# Altium project OSSI-1 OBC.PrjPcb
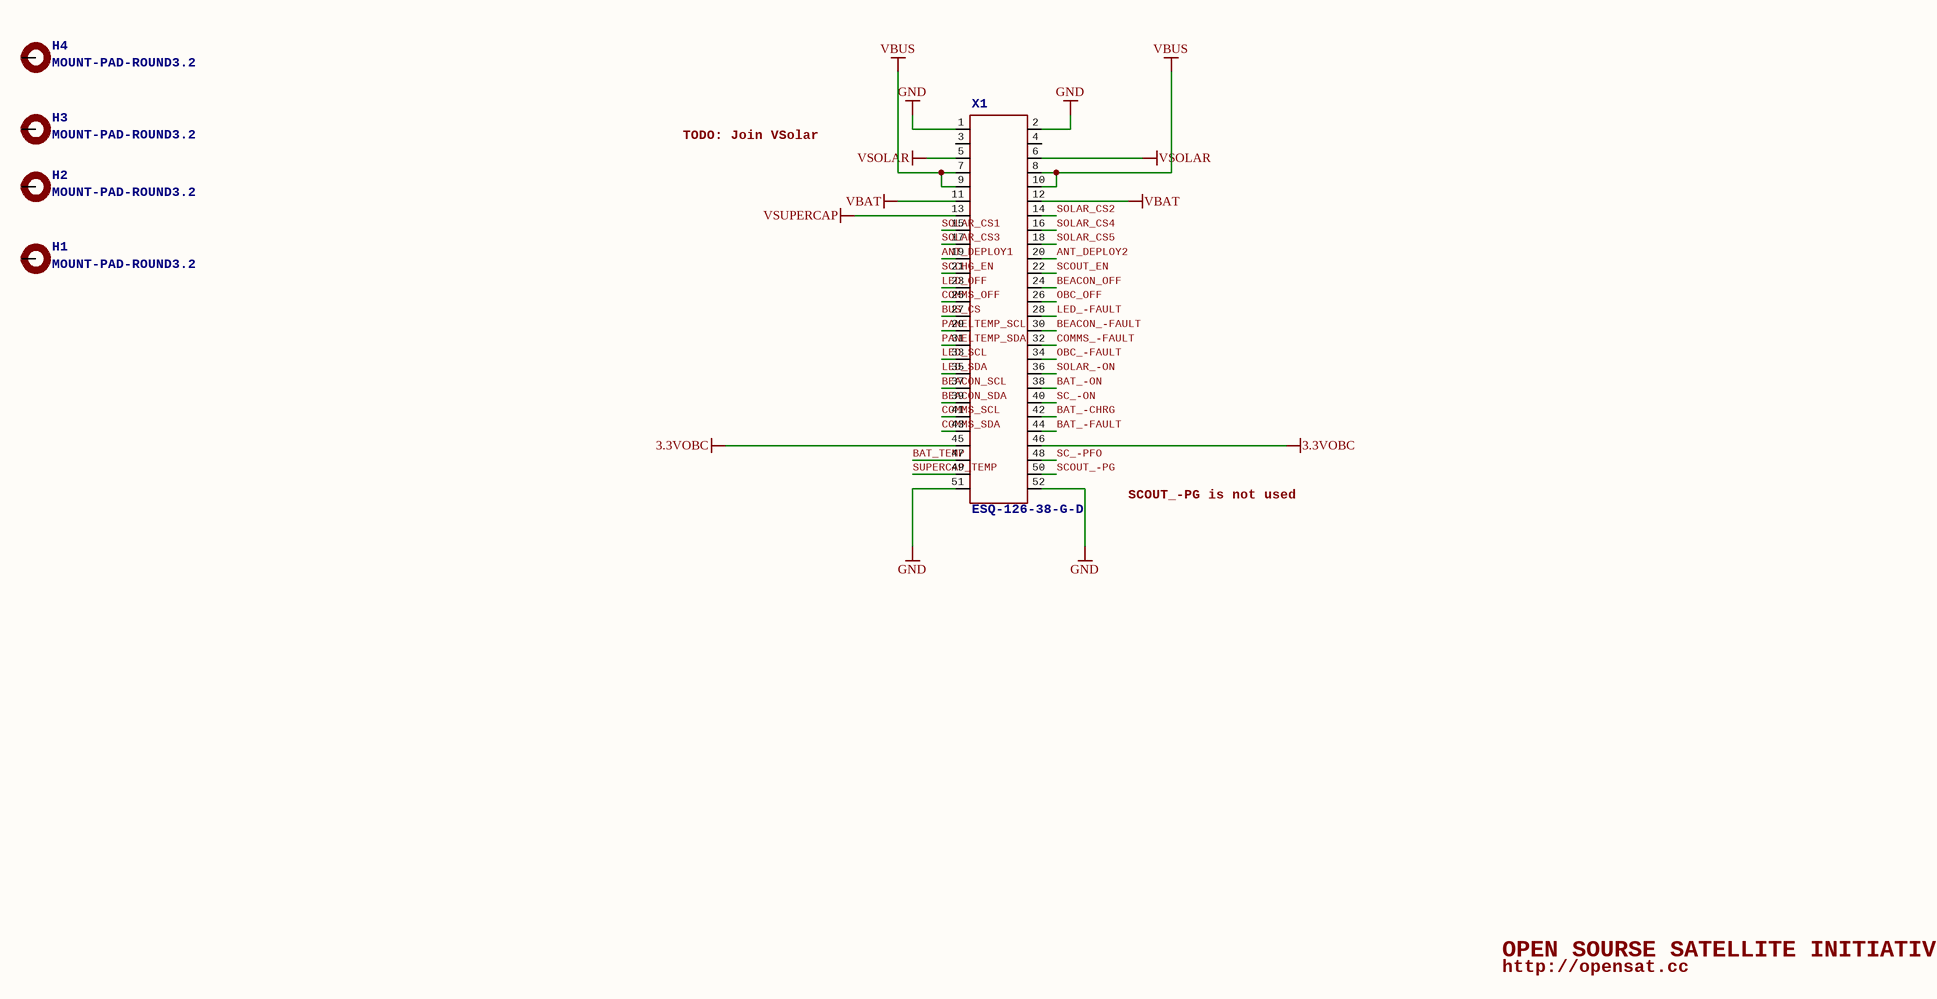
[diagram p0: OSSI-1 OBC_0.SchDoc]
4 sheets, 158 parts. Net scope: global (net labels, ports and power ports of the same name join across sheets).
Board file: OSSI-1 OBC.PcbDoc
Sheets:
  OSSI-1 OBC_0.SchDoc
  OSSI-1 OBC_1.SchDoc
  OSSI-1 OBC_2.SchDoc
  OSSI-1 OBC_3.SchDoc

## Sheet OSSI-1 OBC_0.SchDoc: TITLE:
size 410 x 286 mm; Date: Date:; >LAST_DATE_TIME: 01/11/2015 13:38:39; Sheet:: Sheet:; >SHEET: 1; REV:: REV:; Document Number:: Document Number:; >DRAWING_NAME: OSSI-1 OBC.sch

### Parts
H1  >NAME: H1  [3.2-PAD-ROUND]  (hidden comment: MOUNT-PAD-ROUND3.2)
H2  >NAME: H2  [3.2-PAD-ROUND]  (hidden comment: MOUNT-PAD-ROUND3.2)
H3  >NAME: H3  [3.2-PAD-ROUND]  (hidden comment: MOUNT-PAD-ROUND3.2)
H4  >NAME: H4  [3.2-PAD-ROUND]  (hidden comment: MOUNT-PAD-ROUND3.2)
X1  >NAME: X1  [ESQ-126-XX-X-D]  (hidden comment: ESQ-126-38-G-D)

### Nets
3.3VOBC: X1.45 X1.46
GND: X1.1 X1.2 X1.51 X1.52
VBAT: X1.11 X1.12
VBUS: X1.7 X1.8 X1.9 X1.10
VSOLAR: X1.5 X1.6
VSUPERCAP: X1.13
ANT_DEPLOY1: X1.19
ANT_DEPLOY2: X1.20
BAT_-CHRG: X1.42
BAT_-FAULT: X1.44
BAT_-ON: X1.38
BAT_TEMP: X1.47
BEACON_-FAULT: X1.30
BEACON_OFF: X1.24
BEACON_SCL: X1.37
BEACON_SDA: X1.39
BUS_CS: X1.27
COMMS_-FAULT: X1.32
COMMS_OFF: X1.25
COMMS_SCL: X1.41
COMMS_SDA: X1.43
LED_-FAULT: X1.28
LED_OFF: X1.23
LED_SCL: X1.33
LED_SDA: X1.35
OBC_-FAULT: X1.34
OBC_OFF: X1.26
PANELTEMP_SCL: X1.29
PANELTEMP_SDA: X1.31
SC_-ON: X1.40
SC_-PFO: X1.48
SCCHG_EN: X1.21
SCOUT_-PG: X1.50
SCOUT_EN: X1.22
SOLAR_-ON: X1.36
SOLAR_CS1: X1.15
SOLAR_CS2: X1.14
SOLAR_CS3: X1.17
SOLAR_CS4: X1.16
SOLAR_CS5: X1.18
SUPERCAP_TEMP: X1.49

Not connected (* = marked no-connect by the designer): H1 B3,2(MOUNT); H2 B3,2(MOUNT); H3 B3,2(MOUNT); H4 B3,2(MOUNT); X1 3 4

### Notes on the sheet
- TODO: Join VSolar
- SCOUT_-PG is not used
- OPEN SOURSE SATELLITE INITIATIVE
- http://opensat.cc

### Library data of the parts
X1 = ESQ-126-38-G-D: <b>Samtec ESQ-126-XX-G-D Elevated Sockets Seires</b> / <ul> / <li> ESQ-126-37-G-D</li> / <li> ESQ-126-38-G-D</li> / <li> ESQ-126-39-G-D</li> / </ul>; >VALUE: ESQ-126-38-G-D
H1-H4 = MOUNT-PAD-ROUND3.2: >VALUE: MOUNT-PAD-ROUND3.2

## Sheet OSSI-1 OBC_1.SchDoc: TITLE:
size 410 x 286 mm; Date: Date:; >LAST_DATE_TIME: 01/11/2015 13:38:41; Sheet:: Sheet:; >SHEET: 2; REV:: REV:; Document Number:: Document Number:; >DRAWING_NAME: OSSI-1 OBC.sch
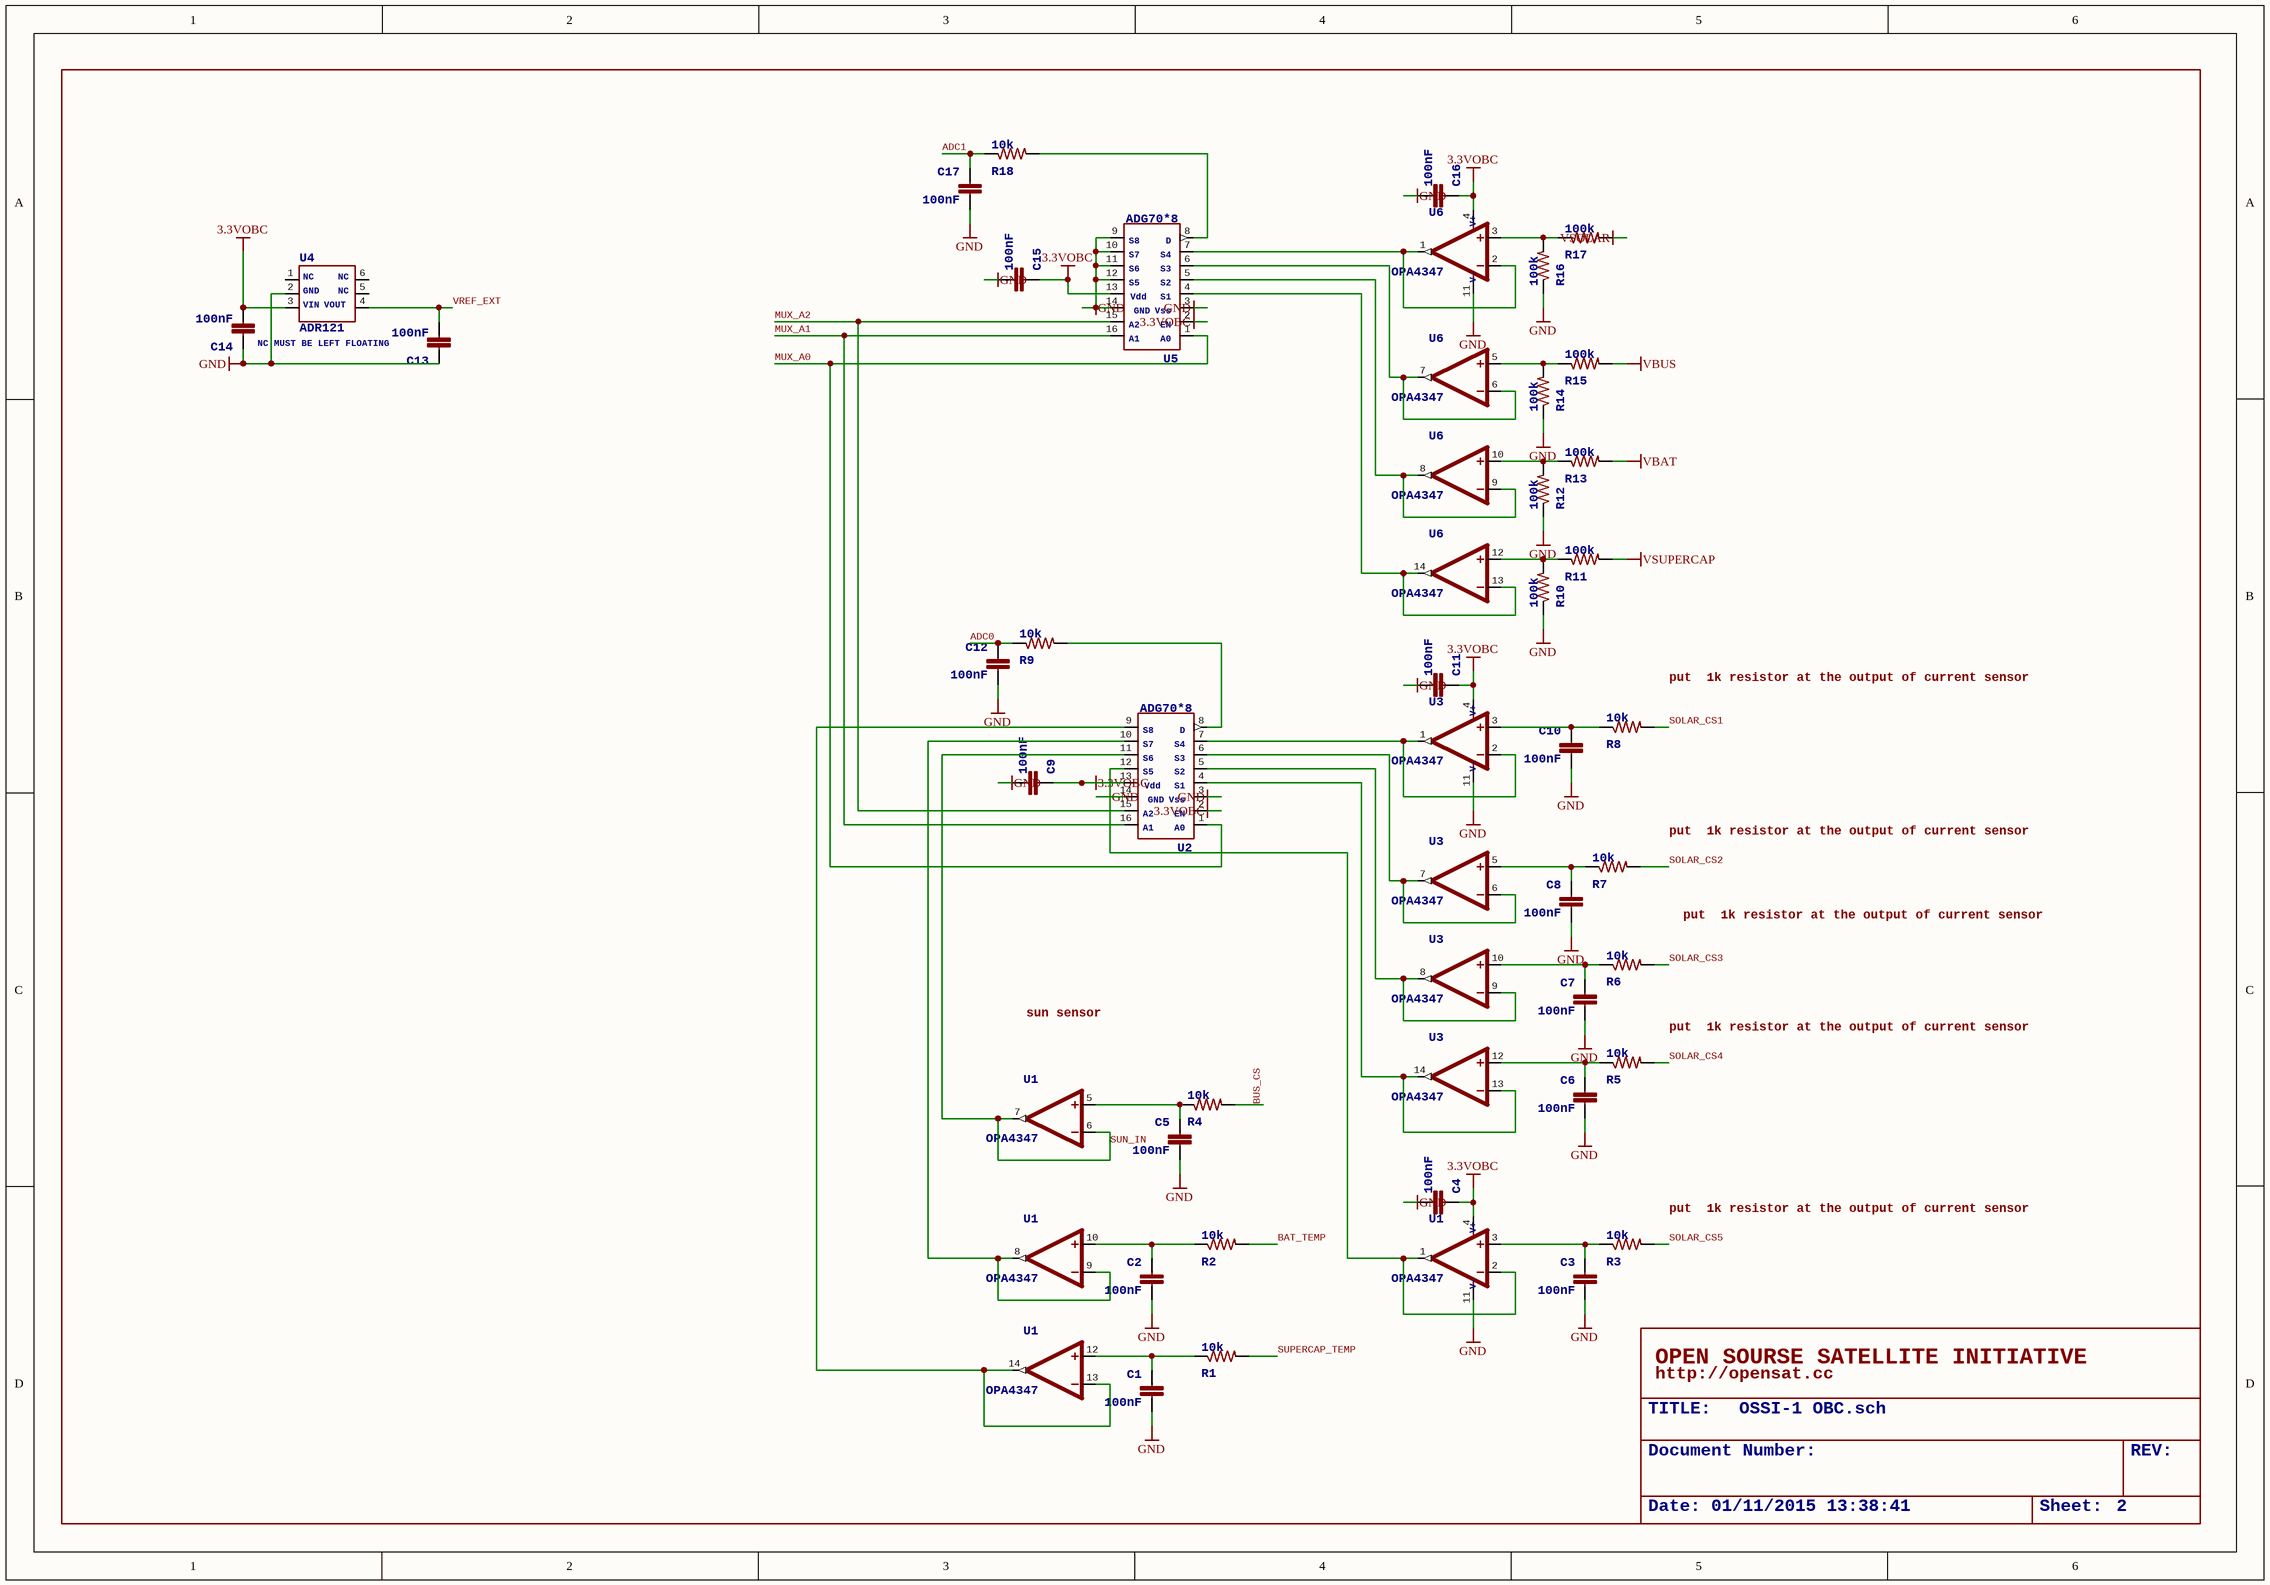
[diagram p1: OSSI-1 OBC_1.SchDoc]

### Parts
C1  >NAME: C1  [C0603(1608)]  (hidden comment: 100nF)
C2  >NAME: C2  [C0603(1608)]  (hidden comment: 100nF)
C3  >NAME: C3  [C0603(1608)]  (hidden comment: 100nF)
C4  >NAME: C4  [C0603(1608)]  (hidden comment: 100nF)
C5  >NAME: C5  [C0603(1608)]  (hidden comment: 100nF)
C6  >NAME: C6  [C0603(1608)]  (hidden comment: 100nF)
C7  >NAME: C7  [C0603(1608)]  (hidden comment: 100nF)
C8  >NAME: C8  [C0603(1608)]  (hidden comment: 100nF)
C9  >NAME: C9  [C0603(1608)]  (hidden comment: 100nF)
C10  >NAME: C10  [C0603(1608)]  (hidden comment: 100nF)
C11  >NAME: C11  [C0603(1608)]  (hidden comment: 100nF)
C12  >NAME: C12  [C0603(1608)]  (hidden comment: 100nF)
C13  >NAME: C13  [C0603(1608)]  (hidden comment: 100nF)
C14  >NAME: C14  [C0603(1608)]  (hidden comment: 100nF)
C15  >NAME: C15  [C0603(1608)]  (hidden comment: 100nF)
C16  >NAME: C16  [C0603(1608)]  (hidden comment: 100nF)
C17  >NAME: C17  [C0603(1608)]  (hidden comment: 100nF)
R1  >NAME: R1  [R0603(1608)]  (hidden comment: 10k)
R2  >NAME: R2  [R0603(1608)]  (hidden comment: 10k)
R3  >NAME: R3  [R0603(1608)]  (hidden comment: 10k)
R4  >NAME: R4  [R0603(1608)]  (hidden comment: 10k)
R5  >NAME: R5  [R0603(1608)]  (hidden comment: 10k)
R6  >NAME: R6  [R0603(1608)]  (hidden comment: 10k)
R7  >NAME: R7  [R0603(1608)]  (hidden comment: 10k)
R8  >NAME: R8  [R0603(1608)]  (hidden comment: 10k)
R9  >NAME: R9  [R0603(1608)]  (hidden comment: 10k)
R10  >NAME: R10  [R0603(1608)]  (hidden comment: 100k)
R11  >NAME: R11  [R0603(1608)]  (hidden comment: 100k)
R12  >NAME: R12  [R0603(1608)]  (hidden comment: 100k)
R13  >NAME: R13  [R0603(1608)]  (hidden comment: 100k)
R14  >NAME: R14  [R0603(1608)]  (hidden comment: 100k)
R15  >NAME: R15  [R0603(1608)]  (hidden comment: 100k)
R16  >NAME: R16  [R0603(1608)]  (hidden comment: 100k)
R17  >NAME: R17  [R0603(1608)]  (hidden comment: 100k)
R18  >NAME: R18  [R0603(1608)]  (hidden comment: 10k)
U1  >NAME: U1  [TSSOP14-PW]  (hidden comment: OPA4347)  (parts A,B,C,D of 4)
U2  >NAME: U2  [TSSOP16-RU]  (hidden comment: ADG70*8)
U3  >NAME: U3  [TSSOP14-PW]  (hidden comment: OPA4347)  (parts A,B,C,D of 4)
U4  >NAME: U4  [TSOT-6UJ-6]  (hidden comment: ADR121)
U5  >NAME: U5  [TSSOP16-RU]  (hidden comment: ADG70*8)
U6  >NAME: U6  [TSSOP14-PW]  (hidden comment: OPA4347)  (parts A,B,C,D of 4)

### Nets
3.3VOBC: C4.1 C9.1 C11.1 C14.2 C15.1 C16.1 U1.4(V+) U2.2(P$2) U2.13(P$13) U3.4(V+) U4.3(P$3) U5.2(P$2) U5.13(P$13) U6.4(V+)
GND: C1.2 C2.2 C3.2 C4.2 C5.2 C6.2 C7.2 C8.2 C9.2 C10.2 C11.2 C12.2 C13.1 C14.1 C15.2 C16.2 C17.2 R10.1 R12.1 R14.1 R16.1 U1.11(V-) U2.3(P$3) U2.14(P$14) U3.11(V-) U4.2(P$2) U5.3(P$3) U5.9(P$9) U5.10(P$10) U5.11(P$11) U5.12(P$12) U5.14(P$14) U6.11(V-)
VBAT: R13.2
VBUS: R15.2
VSOLAR: R17.2
VSUPERCAP: R11.2
ADC0: C12.1 R9.1
ADC1: C17.1 R18.1
BAT_TEMP: R2.2
BUS_CS: R4.2
MUX_A0: U2.1(P$1) U5.1(P$1)
MUX_A1: U2.16(P$16) U5.16(P$16)
MUX_A2: U2.15(P$15) U5.15(P$15)
SOLAR_CS1: R8.2
SOLAR_CS2: R7.2
SOLAR_CS3: R6.2
SOLAR_CS4: R5.2
SOLAR_CS5: R3.2
SUN_IN: U1.6(-IN) U1.7(OUT) U2.11(P$11)
SUPERCAP_TEMP: R1.2
VREF_EXT: C13.2 U4.4(P$4)
NetC1_1: C1.1 R1.1 U1.12(+IN)
NetC2_1: C2.1 R2.1 U1.10(+IN)
NetC3_1: C3.1 R3.1 U1.3(+IN)
NetC5_1: C5.1 R4.1 U1.5(+IN)
NetC6_1: C6.1 R5.1 U3.12(+IN)
NetC7_1: C7.1 R6.1 U3.10(+IN)
NetC8_1: C8.1 R7.1 U3.5(+IN)
NetC10_1: C10.1 R8.1 U3.3(+IN)
NetR9_2: R9.2 U2.8(P$8)
NetR10_2: R10.2 R11.1 U6.12(+IN)
NetR12_2: R12.2 R13.1 U6.10(+IN)
NetR14_2: R14.2 R15.1 U6.5(+IN)
NetR16_2: R16.2 R17.1 U6.3(+IN)
NetR18_2: R18.2 U5.8(P$8)
NetU1_1: U1.1(OUT) U1.2(-IN) U2.12(P$12)
NetU1_8: U1.8(OUT) U1.9(-IN) U2.10(P$10)
NetU1_13: U1.13(-IN) U1.14(OUT) U2.9(P$9)
NetU2_4: U2.4(P$4) U3.13(-IN) U3.14(OUT)
NetU2_5: U2.5(P$5) U3.8(OUT) U3.9(-IN)
NetU2_6: U2.6(P$6) U3.6(-IN) U3.7(OUT)
NetU2_7: U2.7(P$7) U3.1(OUT) U3.2(-IN)
NetU5_4: U5.4(P$4) U6.13(-IN) U6.14(OUT)
NetU5_5: U5.5(P$5) U6.8(OUT) U6.9(-IN)
NetU5_6: U5.6(P$6) U6.6(-IN) U6.7(OUT)
NetU5_7: U5.7(P$7) U6.1(OUT) U6.2(-IN)

Not connected (* = marked no-connect by the designer): U4 1(P$1) 5(P$5) 6(P$6)

### Notes on the sheet
- (near R8) put  1k resistor at the output of current sensor
- (near R7) put  1k resistor at the output of current sensor
- put  1k resistor at the output of current sensor
- sun sensor
- (near R3) put  1k resistor at the output of current sensor
- OPEN SOURSE SATELLITE INITIATIVE
- http://opensat.cc

### Library data of the parts
C1-C17 = C0603(1608): >VALUE: 100nF
R1-R18 = R0603(1608)
  R1-R9 R18: >VALUE: 10k
  R10-R17: >VALUE: 100k
U1 U3 U6 = OPA4347: <b>OPA4347</b> / <ul> / <li>RAIL-TO-RAIL INPUT AND OUTPUT</li> / <li>SINGLE SUPPLY: 2.3V to 5.5V</li> / <li>LOW IQ: 20µ</li> / </ul>; >VALUE: OPA4347; V+: V+; V-: V-
U4 = ADR127BUJZ-REEL7: ADR127<br/> / Precision, Micropower LDO Voltage / References in TSOT / <br/>ADR127BUJZ-REEL7; >VALUE: ADR121; NC: NC; GND: GND; VIN: VIN; VOUT: VOUT; NC MUST BE LEFT FLOATING: NC MUST BE LEFT FLOATING
U2 U5 = ADG70*8: A0: A0; EN: EN; Vss: Vss; S1: S1; S2: S2; S3: S3; S4: S4; D: D; S5: S5; S6: S6; S7: S7; S8: S8; Vdd: Vdd; GND: GND; A2: A2; A1: A1; >VALUE: ADG70*8

## Sheet OSSI-1 OBC_2.SchDoc: TITLE:
size 410 x 286 mm; Date: Date:; >LAST_DATE_TIME: 01/11/2015 13:38:44; Sheet:: Sheet:; >SHEET: 3; REV:: REV:; Document Number:: Document Number:; >DRAWING_NAME: OSSI-1 OBC.sch
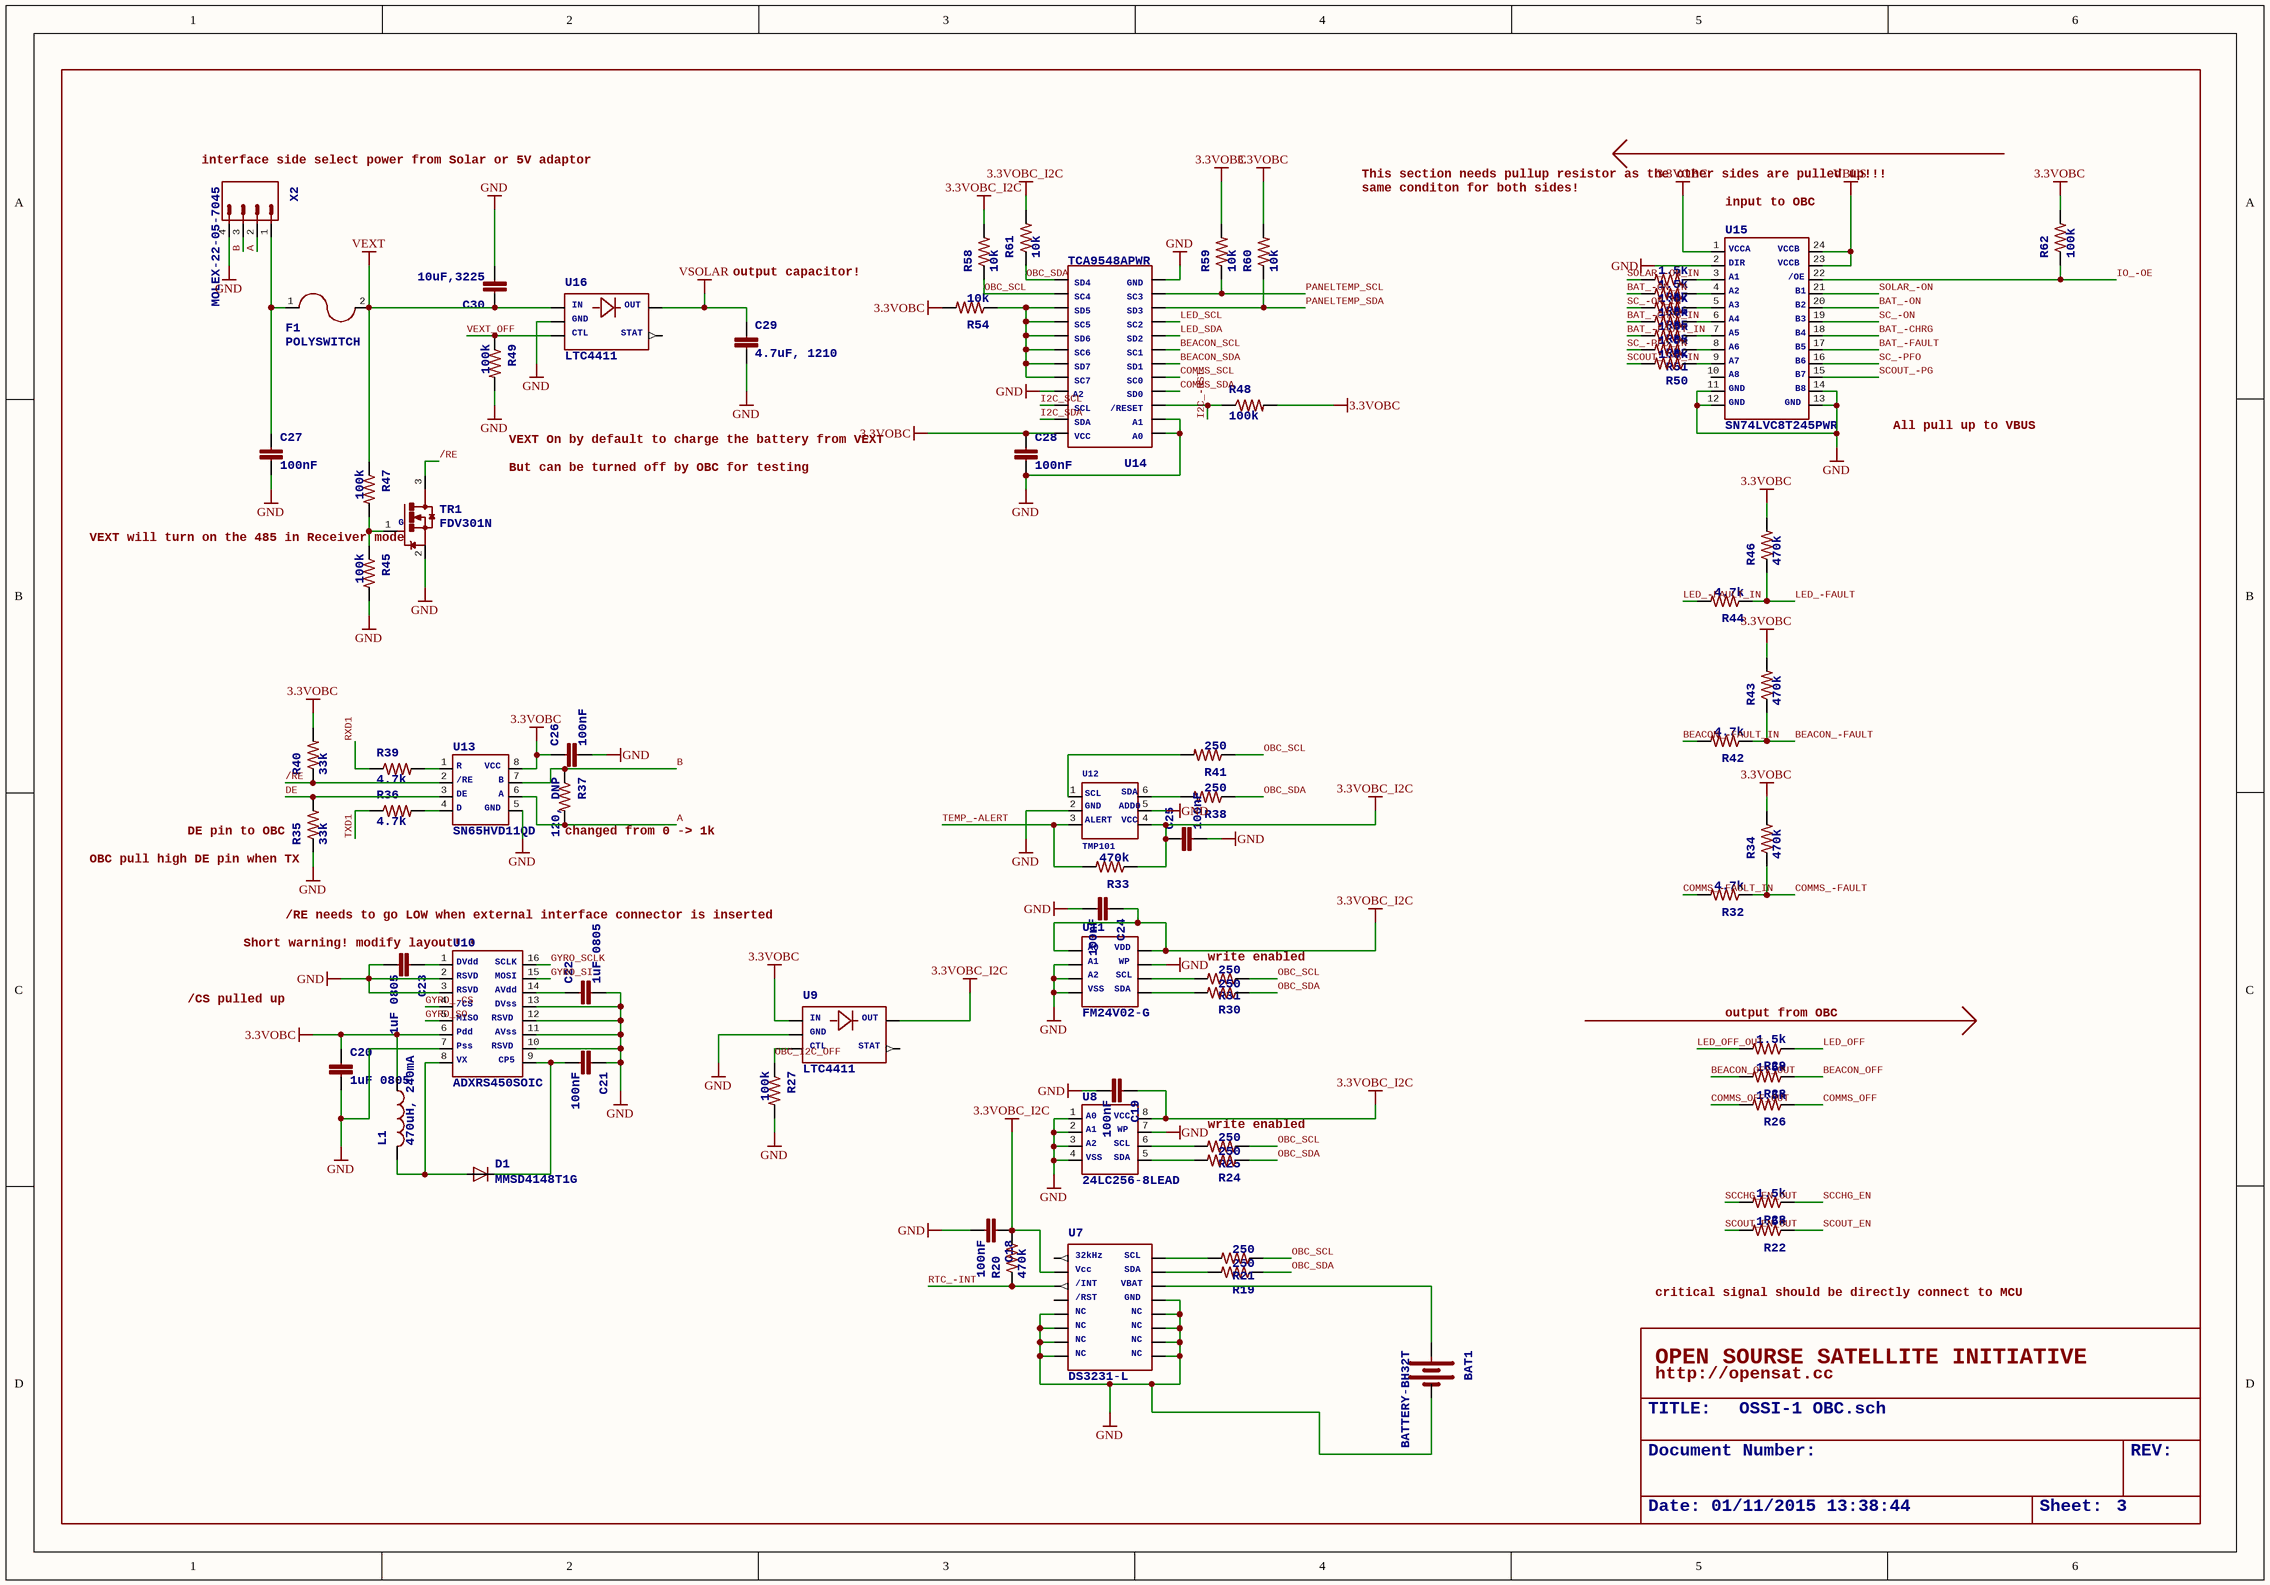
[diagram p2: OSSI-1 OBC_2.SchDoc]

### Parts
BAT1  >NAME: BAT1  [BH32T-C-G]  (hidden comment: BATTERY-BH32T)
C18  >NAME: C18  [C0603(1608)]  (hidden comment: 100nF)
C19  >NAME: C19  [C0603(1608)]  (hidden comment: 100nF)
C20  >NAME: C20  [C0805(2012)]  (hidden comment: 1uF 0805)
C21  >NAME: C21  [C0603(1608)]  (hidden comment: 100nF)
C22  >NAME: C22  [C0805(2012)]  (hidden comment: 1uF 0805)
C23  >NAME: C23  [C0805(2012)]  (hidden comment: 1uF 0805)
C24  >NAME: C24  [C0603(1608)]  (hidden comment: 100nF)
C25  >NAME: C25  [C0603(1608)]  (hidden comment: 100nF)
C26  >NAME: C26  [C0603(1608)]  (hidden comment: 100nF)
C27  >NAME: C27  [C0603(1608)]  (hidden comment: 100nF)
C28  >NAME: C28  [C0603(1608)]  (hidden comment: 100nF)
C29  >NAME: C29  [C1206-GCM31]  (hidden comment: 4.7uF, 1210)
C30  >NAME: C30  [C1210-GCM32]  (hidden comment: 10uF,3225)
D1  >NAME: D1  [SOD-123]  (hidden comment: MMSD4148T1G)
F1  >NAME: F1  [NANOSMDC150FCT]  (hidden comment: POLYSWITCH)
L1  >NAME: L1  [L(2220)]  (hidden comment: 470uH, 240mA)
R19  >NAME: R19  [R0603(1608)]  (hidden comment: 250)
R20  >NAME: R20  [R0603(1608)]  (hidden comment: 470k)
R21  >NAME: R21  [R0603(1608)]  (hidden comment: 250)
R22  >NAME: R22  [R0603(1608)]  (hidden comment: 1.5k)
R23  >NAME: R23  [R0603(1608)]  (hidden comment: 1.5k)
R24  >NAME: R24  [R0603(1608)]  (hidden comment: 250)
R25  >NAME: R25  [R0603(1608)]  (hidden comment: 250)
R26  >NAME: R26  [R0603(1608)]  (hidden comment: 1.5k)
R27  >NAME: R27  [R0603(1608)]  (hidden comment: 100k)
R28  >NAME: R28  [R0603(1608)]  (hidden comment: 1.5k)
R29  >NAME: R29  [R0603(1608)]  (hidden comment: 1.5k)
R30  >NAME: R30  [R0603(1608)]  (hidden comment: 250)
R31  >NAME: R31  [R0603(1608)]  (hidden comment: 250)
R32  >NAME: R32  [R0603(1608)]  (hidden comment: 4.7k)
R33  >NAME: R33  [R0603(1608)]  (hidden comment: 470k)
R34  >NAME: R34  [R0603(1608)]  (hidden comment: 470k)
R35  >NAME: R35  [R0603(1608)]  (hidden comment: 33k)
R36  >NAME: R36  [R0603(1608)]  (hidden comment: 4.7k)
R37  >NAME: R37  [R0603(1608)]  (hidden comment: 120, DNP)
R38  >NAME: R38  [R0603(1608)]  (hidden comment: 250)
R39  >NAME: R39  [R0603(1608)]  (hidden comment: 4.7k)
R40  >NAME: R40  [R0603(1608)]  (hidden comment: 33k)
R41  >NAME: R41  [R0603(1608)]  (hidden comment: 250)
R42  >NAME: R42  [R0603(1608)]  (hidden comment: 4.7k)
R43  >NAME: R43  [R0603(1608)]  (hidden comment: 470k)
R44  >NAME: R44  [R0603(1608)]  (hidden comment: 4.7k)
R45  >NAME: R45  [R0603(1608)]  (hidden comment: 100k)
R46  >NAME: R46  [R0603(1608)]  (hidden comment: 470k)
R47  >NAME: R47  [R0603(1608)]  (hidden comment: 100k)
R48  >NAME: R48  [R0603(1608)]  (hidden comment: 100k)
R49  >NAME: R49  [R0603(1608)]  (hidden comment: 100k)
R50  >NAME: R50  [R0603(1608)]  (hidden comment: 1.5k)
R51  >NAME: R51  [R0603(1608)]  (hidden comment: 1.5k)
R52  >NAME: R52  [R0603(1608)]  (hidden comment: 1.5k)
R53  >NAME: R53  [R0603(1608)]  (hidden comment: 1.5k)
R54  >NAME: R54  [R0603(1608)]  (hidden comment: 10k)
R55  >NAME: R55  [R0603(1608)]  (hidden comment: 1.5k)
R56  >NAME: R56  [R0603(1608)]  (hidden comment: 1.5k)
R57  >NAME: R57  [R0603(1608)]  (hidden comment: 1.5k)
R58  >NAME: R58  [R0603(1608)]  (hidden comment: 10k)
R59  >NAME: R59  [R0603(1608)]  (hidden comment: 10k)
R60  >NAME: R60  [R0603(1608)]  (hidden comment: 10k)
R61  >NAME: R61  [R0603(1608)]  (hidden comment: 10k)
R62  >NAME: R62  [R0603(1608)]  (hidden comment: 100k)
TR1  >NAME: TR1  [SOT23]  (hidden comment: FDV301N)
U7  >NAME: U7  [SO16L]  (hidden comment: DS3231-L)
U8  >NAME: U8  [SO08-208]  (hidden comment: 24LC256-8LEAD)
U9  >NAME: U9  [TSOT23-5]  (hidden comment: LTC4411)
U10  >NAME: U10  [SOIC-16CAV]  (hidden comment: ADXRS450SOIC)
U11  >NAME: U11  [SO8]  (hidden comment: FM24V02-G)
U12  >NAME: U12  [SOT23-6DBV]  (hidden comment: TMP101)
U13  >NAME: U13  [SO8]  (hidden comment: SN65HVD11QD)
U14  >NAME: U14  [TSSOP-24-PW]  (hidden comment: TCA9548APWR)
U15  >NAME: U15  [PW_R-PDSO-G24]  (hidden comment: SN74LVC8T245PWR)
U16  >NAME: U16  [TSOT23-5]  (hidden comment: LTC4411)
X2  >NAME: X2  [22-05-7045]  (hidden comment: MOLEX-22-05-7045)

### Nets
3.3VOBC: C20.1 C26.1 C28.1 L1.P$1 R34.2 R40.2 R43.2 R46.2 R48.2 R54.2 R59.2 R60.2 R62.2 U9.P$1 U10.6(P$6) U13.8(P$8) U14.24(P$24) U15.1(P$1)
3.3VOBC_I2C: C18.1 C19.1 C24.1 C25.1 R20.2 R33.1 R58.2 R61.2 U7.2(P$2) U8.8(P$8) U9.P$5 U11.1(A0) U11.8(VDD) U12.4
GND: BAT1.N(-) C18.2 C19.2 C20.2 C21.1 C22.2 C23.2 C24.2 C25.2 C26.2 C27.2 C28.2 C29.P$2 C30.P$2 R27.2 R35.1 R45.2 R49.2 TR1.2(S) U7.5(P$5) U7.6(P$6) U7.7(P$7) U7.8(P$8) U7.9(P$9) U7.10(P$10) U7.11(P$11) U7.12(P$12) U7.13(P$13) U8.1(P$1) U8.2(P$2) U8.3(P$3) U8.4(P$4) U8.7(P$7) U9.P$2 U10.2(P$2) U10.3(P$3) U10.7(P$7) U10.10(P$10) U10.11(P$11) U10.12(P$12) U10.13(P$13) U11.2(A1) U11.3(A2) U11.4(VSS) U11.7(WP) U12.2 U12.5 U13.5(P$5) U14.1(P$1) U14.2(P$2) U14.12(P$12) U14.21(P$21) U15.2(P$2) U15.11(P$11) U15.12(P$12) U15.13(P$13) U15.14(P$14) U16.P$2 X2.4
VBUS: U15.23(P$23) U15.24(P$24)
VEXT: C30.P$1 F1.2(P$2) R47.1 U16.P$1
VSOLAR: C29.P$1 U16.P$5
/RE: R40.1 TR1.3(D) U13.2(P$2)
A: R37.2 U13.6(P$6) X2.2
B: R37.1 U13.7(P$7) X2.3
BAT_-CHRG: U15.18(P$18)
BAT_-CHRG_IN: R53.2
BAT_-FAULT: U15.17(P$17)
BAT_-FAULT_IN: R52.2
BAT_-ON: U15.20(P$20)
BAT_-ON_IN: R56.2
BEACON_-FAULT: R42.1 R43.1
BEACON_-FAULT_IN: R42.2
BEACON_OFF: R28.1
BEACON_OFF_OUT: R28.2
BEACON_SCL: U14.7(P$7)
BEACON_SDA: U14.6(P$6)
COMMS_-FAULT: R32.1 R34.1
COMMS_-FAULT_IN: R32.2
COMMS_OFF: R26.1
COMMS_OFF_OUT: R26.2
COMMS_SCL: U14.5(P$5)
COMMS_SDA: U14.4(P$4)
DE: R35.2 U13.3(P$3)
GYRO_-CS: U10.4(P$4)
GYRO_SCLK: U10.16(P$16)
GYRO_SI: U10.15(P$15)
GYRO_SO: U10.5(P$5)
I2C_-RST: R48.1 U14.3(P$3)
I2C_SCL: U14.22(P$22)
I2C_SDA: U14.23(P$23)
IO_-OE: R62.1 U15.22(P$22)
LED_-FAULT: R44.1 R46.1
LED_-FAULT_IN: R44.2
LED_OFF: R29.1
LED_OFF_OUT: R29.2
LED_SCL: U14.9(P$9)
LED_SDA: U14.8(P$8)
OBC_I2C_OFF: R27.1 U9.P$3
OBC_SCL: R21.1 R25.1 R31.1 R41.1 R58.1 U14.14(P$14)
OBC_SDA: R19.1 R24.1 R30.1 R38.1 R61.1 U14.13(P$13)
PANELTEMP_SCL: R59.1 U14.11(P$11)
PANELTEMP_SDA: R60.1 U14.10(P$10)
RTC_-INT: R20.1 U7.3(P$3)
RXD1: R39.1
SC_-ON: U15.19(P$19)
SC_-ON_IN: R55.2
SC_-PFO: U15.16(P$16)
SC_-PFO_IN: R51.2
SCCHG_EN: R23.1
SCCHG_EN_OUT: R23.2
SCOUT_-PG: U15.15(P$15)
SCOUT_-PG_IN: R50.2
SCOUT_EN: R22.1
SCOUT_EN_OUT: R22.2
SOLAR_-ON: U15.21(P$21)
SOLAR_-ON_IN: R57.2
TEMP_-ALERT: R33.2 U12.3
TXD1: R36.1
VEXT_OFF: R49.1 U16.P$3
NetBAT1_P: BAT1.P(+) U7.14(P$14)
NetC21_2: C21.2 D1.C U10.9(P$9)
NetC22_1: C22.1 U10.14(P$14)
NetC23_1: C23.1 U10.1(P$1)
NetC27_1: C27.1 F1.1(P$1) X2.1
NetD1_A: D1.A L1.P$2 U10.8(P$8)
NetR19_2: R19.2 U7.15(P$15)
NetR21_2: R21.2 U7.16(P$16)
NetR24_2: R24.2 U8.5(P$5)
NetR25_2: R25.2 U8.6(P$6)
NetR30_2: R30.2 U11.5(SDA)
NetR31_2: R31.2 U11.6(SCL)
NetR36_2: R36.2 U13.4(P$4)
NetR38_2: R38.2 U12.6
NetR39_2: R39.2 U13.1(P$1)
NetR41_2: R41.2 U12.1
NetR45_1: R45.1 R47.2 TR1.1(G)
NetR50_1: R50.1 U15.9(P$9)
NetR51_1: R51.1 U15.8(P$8)
NetR52_1: R52.1 U15.7(P$7)
NetR53_1: R53.1 U15.6(P$6)
NetR54_1: R54.1 U14.15(P$15) U14.16(P$16) U14.17(P$17) U14.18(P$18) U14.19(P$19) U14.20(P$20)
NetR55_1: R55.1 U15.5(P$5)
NetR56_1: R56.1 U15.4(P$4)
NetR57_1: R57.1 U15.3(P$3)

Not connected (* = marked no-connect by the designer): U7 1(P$1) 4(P$4); U9 P$4; U15 10(P$10); U16 P$4

### Notes on the sheet
- interface side select power from Solar or 5V adaptor
- This section needs pullup resistor as the other sides are pulled up!!!
- same conditon for both sides!
- (near U15) input to OBC
- output capacitor!
- VEXT On by default to charge the battery from VEXT
- But can be turned off by OBC for testing
- All pull up to VBUS
- VEXT will turn on the 485 in Receiver mode
- (near R35) DE pin to OBC
- (near R37) changed from 0 -> 1k
- (near R35) OBC pull high DE pin when TX
- Short warning! modify layout!!!
- /RE needs to go LOW when external interface connector is inserted
- (near R31) write enabled
- /CS pulled up
- (near R29) output from OBC
- (near R25) write enabled
- critical signal should be directly connect to MCU
- OPEN SOURSE SATELLITE INITIATIVE
- http://opensat.cc

### Library data of the parts
C18 C19 C21 C24-C28 = C0603(1608): >VALUE: 100nF
C20 C22 C23 = C0805(2012): >VALUE: 1uF 0805
C29 = C1206(3216)-GCM31: >VALUE: 4.7uF, 1210
C30 = C1210(3225)-GCM32: >VALUE: 10uF,3225
F1 = POLYSWITCH: Resettable Polyswitch; >VALUE: POLYSWITCH
L1 = LQH55: >VALUE: 470uH, 240mA
R19-R62 = R0603(1608)
  R19 R21 R24 R25 R30 R31 R38 R41: >VALUE: 250
  R20 R33 R34 R43 R46: >VALUE: 470k
  R22 R23 R26 R28 R29 R50-R53 R55-R57: >VALUE: 1.5k
  R27 R45 R47-R49 R62: >VALUE: 100k
  R32 R36 R39 R42 R44: >VALUE: 4.7k
  R35 R40: >VALUE: 33k
  R37: >VALUE: 120, DNP
  R54 R58-R61: >VALUE: 10k
TR1 = FDV301N: FDV301N Digital N channel - FET / Rdson = 5 Ohm / Vgs = 0.7~1.06V / Ids = 220mA; G: G; >VALUE: FDV301N
U7 = DS3231-L: <b>DS3231</b> / <br /> / Extremely Accureate I2C integrated RTC/TCXO/Crystal by MAXIM; 32kHz: 32kHz; Vcc: Vcc; /INT: /INT; /RST: /RST; NC: NC; GND: GND; VBAT: VBAT; SDA: SDA; SCL: SCL; >VALUE: DS3231-L
U8 = 24LC256-8LEAD: 24LC256<BR/> / 256K I2C™ CMOS Serial EEPROM; >VALUE: 24LC256-8LEAD; A0: A0; A1: A1; A2: A2; VSS: VSS; VCC: VCC; WP: WP; SCL: SCL; SDA: SDA
U9 U16 = LTC4411: <b>Linear Techonology LTC4411 ideal diode</b> / <ul> / <li>Small Regulated Forward Voltage (28mV)</li> / <li>2.6A Maximum Forward Current</li> / <li>2.6V to 5.5V Operating Range</li> / <li>MOSFET based</li> / </ul>; IN: IN; GND: GND; CTL: CTL; OUT: OUT; STAT: STAT; >VALUE: LTC4411
U11 = FM24V02-G: <b>FM24V02</b> / <br /> / 256Kb Serial 3V F-RAM Memory by RAMTRON; A0: A0; A1: A1; A2: A2; VSS: VSS; SDA: SDA; SCL: SCL; WP: WP; VDD: VDD; >VALUE: FM24V02-G
U12 = TMP101: TMP101 Digital Temerature Sensor with I2C Interface from Texas Instruments with Alert Function; >VALUE: TMP101; VCC: VCC; SCL: SCL; SDA: SDA; GND: GND; ADD0: ADD0; ALERT: ALERT
U13 = SN65HVD11QD: SN65HVD11 3.3V RS485 Transceiver <br /> / QD: -40~+125; >VALUE: SN65HVD11QD; R: R; /RE: /RE; DE: DE; D: D; VCC: VCC; B: B; A: A; GND: GND
U14 = PCA9548APWR: <b>PCA9548APWR</b> / <ul> / <li>8-Channel I2C Switch With Reset </li> / <li>1-of-8 Bidirectional Translating Switches</li> / <li></li> / <li>Address by Three Hardware Address Pins for Use of up to Eight Devices</li> / <li>Operating Power: 2.3 V to 5.5 V</li> / <li>Active-Low Reset Input</li> / </ul>; >VALUE: TCA9548APWR; A0: A0; A1: A1; /RESET: /RESET; SD0: SD0; SC0: SC0; SD1: SD1; SC1: SC1; SD2: SD2; SC2: SC2; SD3: SD3; SC3: SC3; GND: GND; SD4: SD4; SC4: SC4; SD5: SD5; SC5: SC5; SD6: SD6; SC6: SC6; SD7: SD7; SC7: SC7; A2: A2; SCL: SCL; SDA: SDA; VCC: VCC
U15 = SN74LVC8T245PWR: SN74LVC8T245<BR/> / 8-BIT DUAL-SUPPLY BUS TRANSCEIVER / WITH CONFIGURABLE VOLTAGE TRANSLATION AND 3-STATE OUTPUTS; >VALUE: SN74LVC8T245PWR; VCCA: VCCA; DIR: DIR; A1: A1; A2: A2; A3: A3; A4: A4; A5: A5; A6: A6; A7: A7; A8: A8; GND: GND; B1: B1; VCCB: VCCB; /OE: /OE; B2: B2; B3: B3; B4: B4; B5: B5; B6: B6; B7: B7; B8: B8
X2 = MOLEX-22-05-7045: molex spoxt 5268 series 22-05-7045 for external interface; >VALUE: MOLEX-22-05-7045
BAT1 = BATTERY-BH32T: >VALUE: BATTERY-BH32T
D1 = MMSD4148T1G: >VALUE: MMSD4148T1G
U10 = ADXRS450SOIC: >VALUE: ADXRS450SOIC; DVdd: DVdd; RSVD: RSVD; /CS: /CS; MISO: MISO; Pdd: Pdd; Pss: Pss; VX: VX; CP5: CP5; AVss: AVss; DVss: DVss; AVdd: AVdd; MOSI: MOSI; SCLK: SCLK

## Sheet OSSI-1 OBC_3.SchDoc: TITLE:
size 410 x 286 mm; Date: Date:; >LAST_DATE_TIME: 01/11/2015 13:38:47; Sheet:: Sheet:; >SHEET: 4; REV:: REV:; Document Number:: Document Number:; >DRAWING_NAME: OSSI-1 OBC.sch
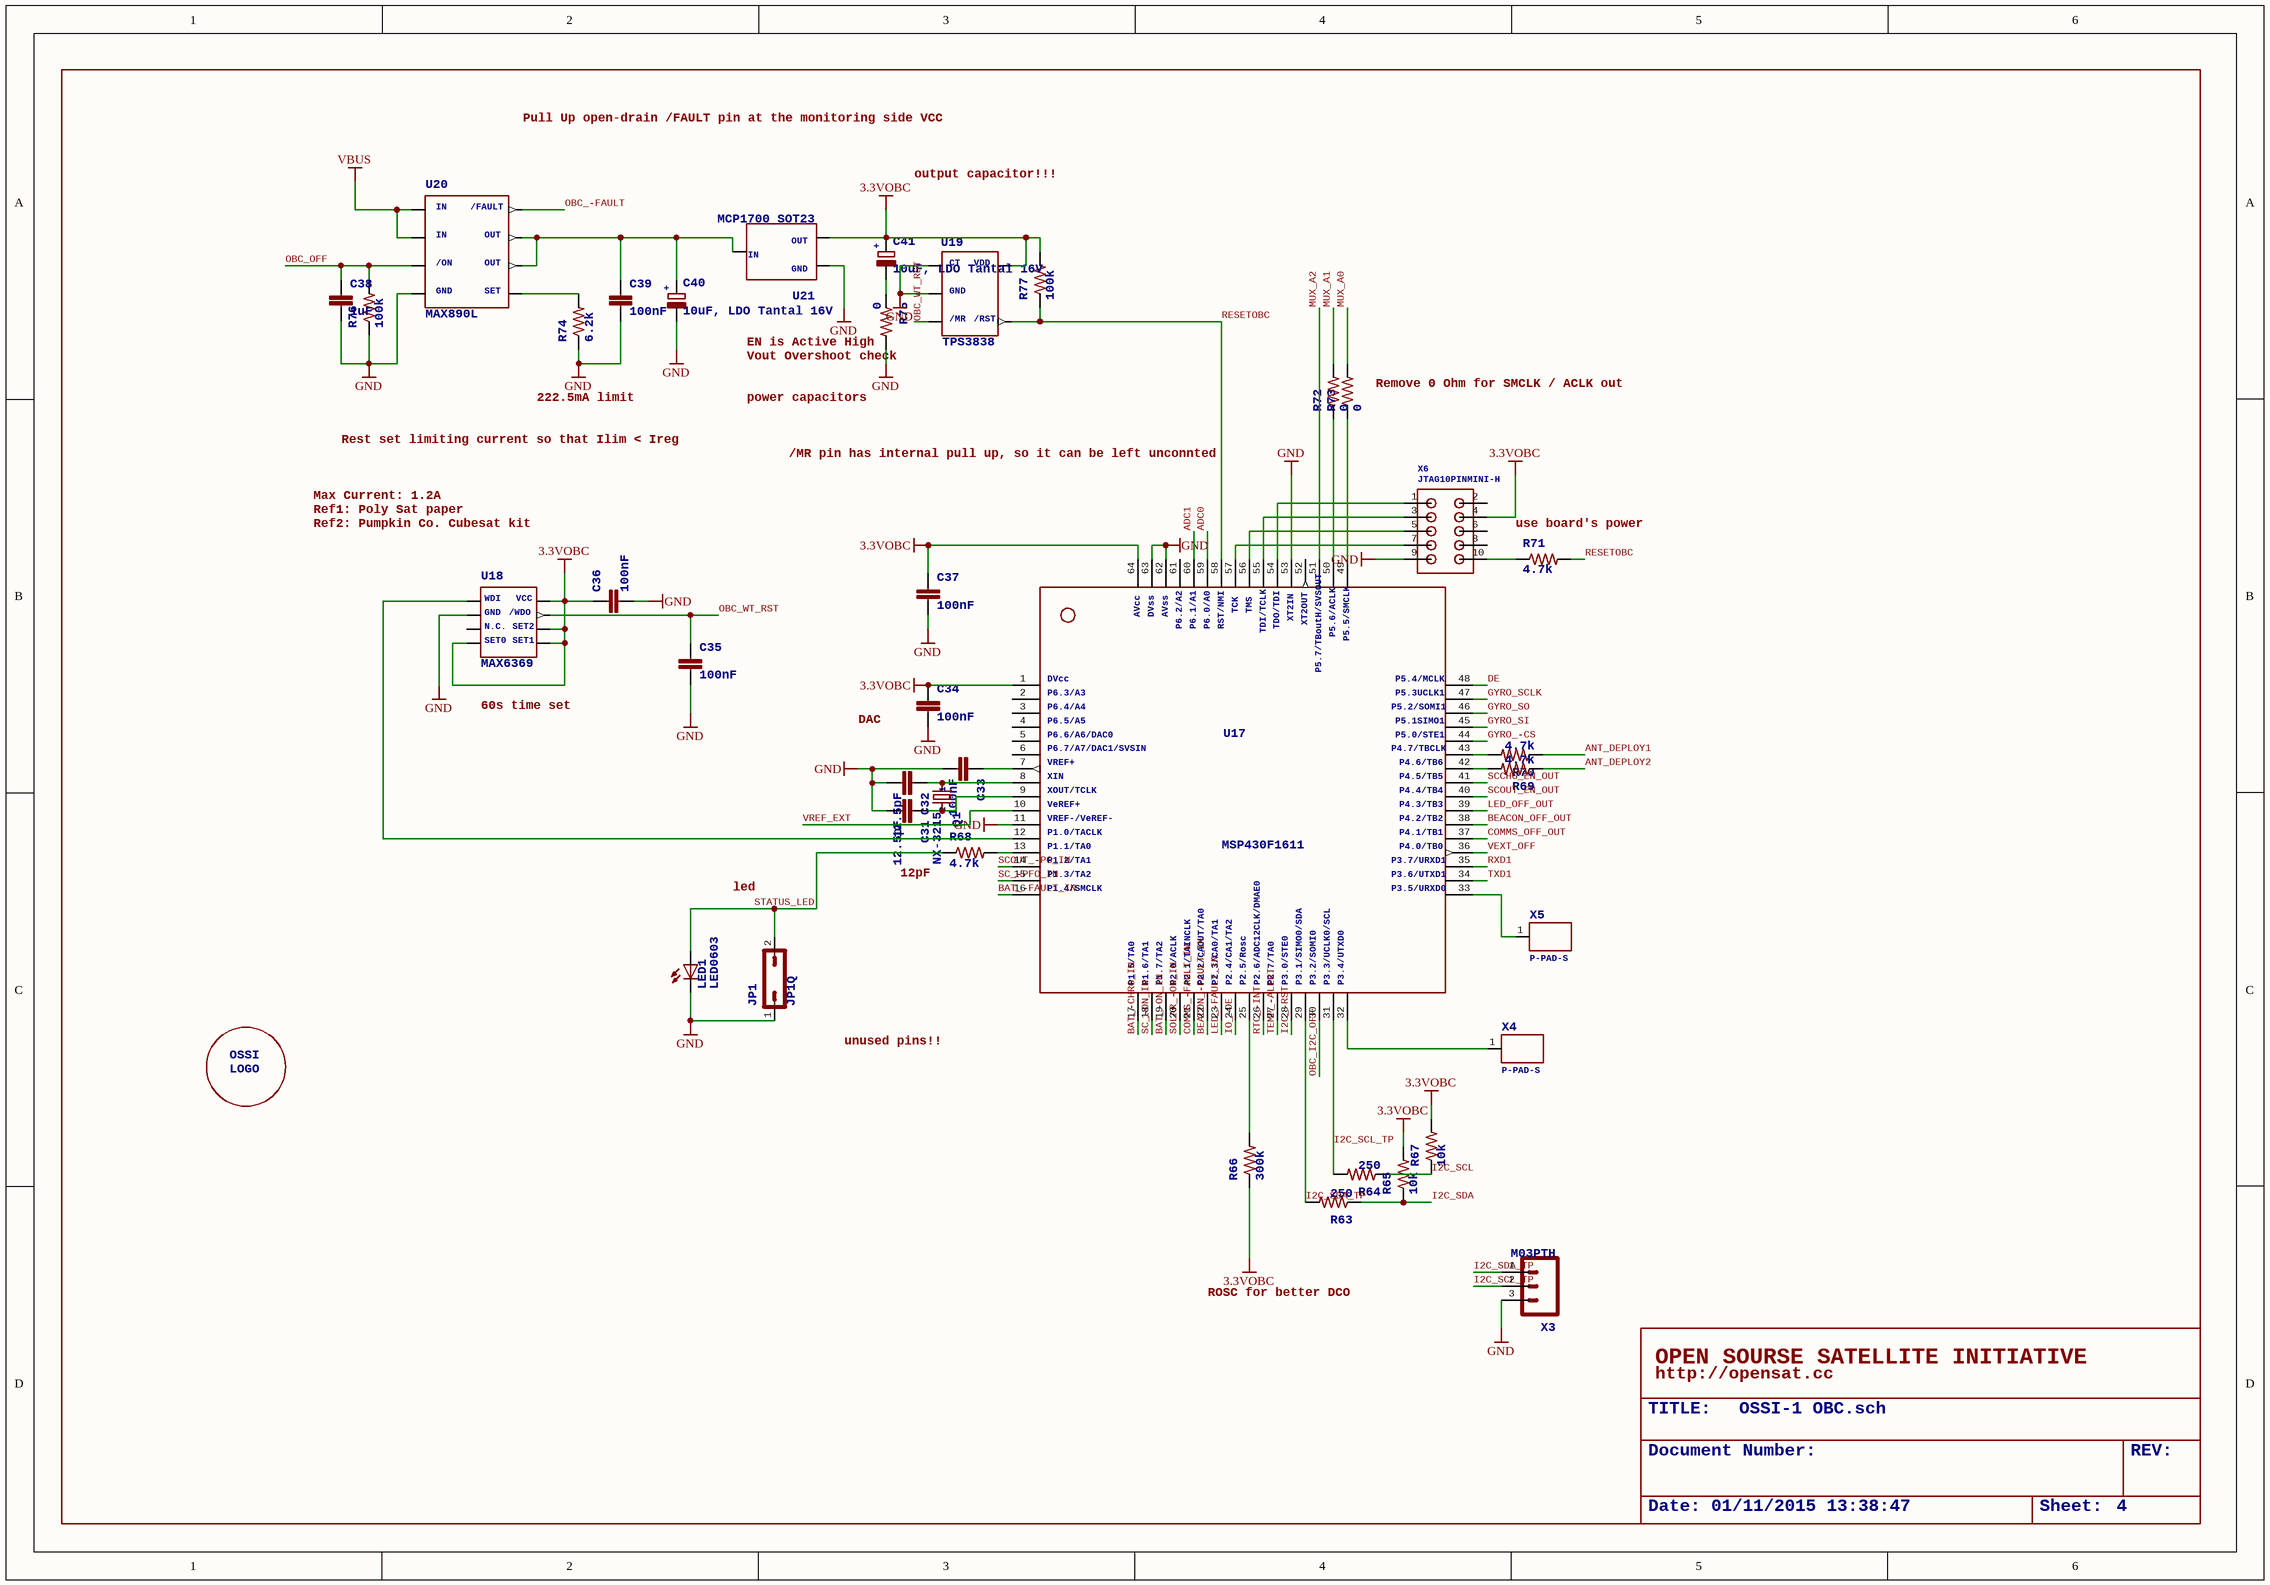
[diagram p3: OSSI-1 OBC_3.SchDoc]

### Parts
C31  >NAME: C31  [C0603(1608)]  (hidden comment: 12.5pF)
C32  >NAME: C32  [C0603(1608)]  (hidden comment: 12.5pF)
C33  >NAME: C33  [C0603(1608)]  (hidden comment: 100nF)
C34  >NAME: C34  [C0603(1608)]  (hidden comment: 100nF)
C35  >NAME: C35  [C0603(1608)]  (hidden comment: 100nF)
C36  >NAME: C36  [C0603(1608)]  (hidden comment: 100nF)
C37  >NAME: C37  [C0603(1608)]  (hidden comment: 100nF)
C38  >NAME: C38  [C0603(1608)]  (hidden comment: 1uF)
C39  >NAME: C39  [C0603(1608)]  (hidden comment: 100nF)
C40  >NAME: C40  [C1206(3216)-A]  (hidden comment: 10uF, LDO Tantal 16V)
C41  >NAME: C41  [C1206(3216)-A]  (hidden comment: 10uF, LDO Tantal 16V)
JP1  JP1Q  [JP1]
LED1  >NAME: LED1  [LED-0603]  (hidden comment: LED0603)
Q1  >NAME: Q1  [NX-3215]  (hidden comment: NX-3215)
R63  >NAME: R63  [R0603(1608)]  (hidden comment: 250)
R64  >NAME: R64  [R0603(1608)]  (hidden comment: 250)
R65  >NAME: R65  [R0603(1608)]  (hidden comment: 10k)
R66  >NAME: R66  [R0603(1608)]  (hidden comment: 300k)
R67  >NAME: R67  [R0603(1608)]  (hidden comment: 10k)
R68  >NAME: R68  [R0603(1608)]  (hidden comment: 4.7k)
R69  >NAME: R69  [R0603(1608)]  (hidden comment: 4.7k)
R70  >NAME: R70  [R0603(1608)]  (hidden comment: 4.7k)
R71  >NAME: R71  [R0603(1608)]  (hidden comment: 4.7k)
R72  >NAME: R72  [R0603(1608)]  (hidden comment: 0)
R73  >NAME: R73  [R0603(1608)]  (hidden comment: 0)
R74  >NAME: R74  [R0603(1608)]  (hidden comment: 6.2k)
R75  >NAME: R75  [R0603(1608)]  (hidden comment: 0)
R76  >NAME: R76  [R0603(1608)]  (hidden comment: 100k)
R77  >NAME: R77  [R0603(1608)]  (hidden comment: 100k)
U17  >NAME: U17  [PM/PAG64]  (hidden comment: MSP430F1611)
U18  >NAME: U18  [SOT23-8]  (hidden comment: MAX6369)
U19  >NAME: U19  [SOT23-5DBV]  (hidden comment: TPS3838)
U20  >NAME: U20  [SO8]  (hidden comment: MAX890L)
U21  >NAME: U21  [SOT23]  (hidden comment: MCP1700_SOT23)
U$1  OSSILOGORECT  [OSSILOGORECT1005]  (value not drawn)
X3  >NAME: X3  [1X03]  (hidden comment: M03PTH)
X4  >NAME: X4  [P-PAD-S]  (hidden comment: P-PAD-S)
X5  >NAME: X5  [P-PAD-S]  (hidden comment: P-PAD-S)
X6  >NAME: X6  [M50-3200545]  (hidden comment: JTAG10PINMINI-H)

### Nets
3.3VOBC: C34.1 C36.1 C37.1 C41.1(+) R65.2 R66.1 R67.2 R77.2 U17.1 U17.64 U18.4(P$4) U18.5(P$5) U18.6(P$6) U18.8(P$8) U19.5(P$5) U21.2 X6.4
GND: C31.2 C32.2 C33.2 C34.2 C35.2 C36.2 C37.2 C38.2 C39.2 C40.2(-) JP1.1 LED1.C R74.1 R75.2 R76.1 U17.11 U17.53 U17.62 U17.63 U18.2(P$2) U19.1(P$1) U19.2(P$2) U20.4(P$4) U21.1 X3.3 X6.9
VBUS: U20.1(P$1) U20.2(P$2)
ADC0: U17.59
ADC1: U17.60
ANT_DEPLOY1: R70.1
ANT_DEPLOY2: R69.1
BAT_-CHRG_IN: U17.17
BAT_-FAULT_IN: U17.16
BAT_-ON_IN: U17.19
BEACON_-FAULT_IN: U17.22
BEACON_OFF_OUT: U17.38
COMMS_-FAULT_IN: U17.21
COMMS_OFF_OUT: U17.37
DE: U17.48
GYRO_-CS: U17.44
GYRO_SCLK: U17.47
GYRO_SI: U17.45
GYRO_SO: U17.46
I2C_-RST: U17.28
I2C_SCL: R64.1 R67.1
I2C_SCL_TP: R64.2 U17.31 X3.2
I2C_SDA: R63.1 R65.1
I2C_SDA_TP: R63.2 U17.29 X3.1
IO_-OE: U17.24
LED_-FAULT_IN: U17.23
LED_OFF_OUT: U17.39
MUX_A0: R73.2
MUX_A1: R72.2
MUX_A2: U17.51
OBC_-FAULT: U20.8(P$8)
OBC_I2C_OFF: U17.30
OBC_OFF: C38.1 R76.2 U20.3(P$3)
OBC_WT_RST: C35.1 U18.7(P$7) U19.3(P$3)
RESETOBC: R71.2 R77.1 U17.58 U19.4(P$4)
RTC_-INT: U17.26
RXD1: U17.35
SC_-ON_IN: U17.18
SC_-PFO_IN: U17.15
SCCHG_EN_OUT: U17.41
SCOUT_-PG_IN: U17.14
SCOUT_EN_OUT: U17.40
SOLAR_-ON_IN: U17.20
STATUS_LED: JP1.2 LED1.A R68.1
TEMP_-ALERT: U17.27
TXD1: U17.34
VEXT_OFF: U17.36
VREF_EXT: U17.10
NetC31_1: C31.1 Q1.2 U17.9
NetC32_1: C32.1 Q1.1 U17.8
NetC33_1: C33.1 U17.7
NetC39_1: C39.1 C40.1(+) U20.6(P$6) U20.7(P$7) U21.3
NetC41_2: C41.2(-) R75.1
NetR66_2: R66.2 U17.25
NetR68_2: R68.2 U17.13
NetR69_2: R69.2 U17.42
NetR70_2: R70.2 U17.43
NetR71_1: R71.1 X6.10
NetR72_1: R72.1 U17.50
NetR73_1: R73.1 U17.49
NetR74_2: R74.2 U20.5(P$5)
NetU17_12: U17.12 U18.1(P$1)
NetU17_32: U17.32 X4.1(P$1)
NetU17_33: U17.33 X5.1(P$1)
NetU17_54: U17.54 X6.1
NetU17_55: U17.55 X6.3
NetU17_56: U17.56 X6.5
NetU17_57: U17.57 X6.7

Not connected (* = marked no-connect by the designer): U17 2 3 4 5 6 52 61; U18 3(P$3); X6 2 6 8

### Notes on the sheet
- Pull Up open-drain /FAULT pin at the monitoring side VCC
- output capacitor!!!
- (near R75) EN is Active High
- 222.5mA limit
- (near R75) Vout Overshoot check
- power capacitors
- Remove 0 Ohm for SMCLK / ACLK out
- Rest set limiting current so that Ilim < Ireg
- /MR pin has internal pull up, so it can be left unconnted
- Max Current: 1.2A
- Ref1: Poly Sat paper
- Ref2: Pumpkin Co. Cubesat kit
- (near R71) use board's power
- 60s time set
- DAC
- led
- (near R68) 12pF
- unused pins!!
- ROSC for better DCO
- OPEN SOURSE SATELLITE INITIATIVE
- http://opensat.cc

### Library data of the parts
C31-C39 = C0603(1608)
  C31 C32: >VALUE: 12.5pF
  C33-C37 C39: >VALUE: 100nF
  C38: >VALUE: 1uF
C40 C41 = C-TANTAL-A: <b>TAJA105M020RNJ</b> / <ul> / <li>Tantal Capacitor / </li> / <li>Manufacturer: AVX / </li> / <li>1206(3126) / </li> / <li>Ref: www.avx.com/docs/techinfo/tantappl.pdf</li> / </ul>; +: +; >VALUE: 10uF, LDO Tantal 16V
JP1 = JP1Q: <b>JUMPER</b>; >NAME: JP1; >VALUE: JP1Q
LED1 = LED0603: <b>LEDs</b> / Standard schematic elements and footprints for 5mm, 3mm, 1206, and 0603 sized LEDs. 5mm - Spark Fun Electronics SKU : COM-00529 (and others); >VALUE: LED0603
Q1 = NX-3215: NDK 32.768 kHz SMD Crystal<br /> / P/N: NX3215SA-32.768K-STD-MUA-9<br /> / <br /> / <b>Nominal frequency (kHz):</b> 32.768 <br/> / <b>Package Size (L×W×H : mm):</b>  3.2×1.5×0.8 <br/> / <b>Operating Temperature Range(*1)  /  Storage Temperature Range   (°C):</b>  -40 to +85  /  -40 to +85<br/> / <b>Level of drive:</b>   0.1µW (Max. 0.5µW) <br/> / <b>Frequency Tolerance (25±3°C):</b>  ±20×10-6 <br/> / <b>Load Capacitance:</b>  9.0pF, 12.5pF <br/> / <b>Equivalent Series Resistance:</b>  70kΩ Max.<br/> / <b>Ordering Code:</b>  NX3215SA-32.768K-STD-MUA-9 (Load Capacitance9.0pF) /NX3215SA-32.768K-STD-MUA-8 (Load Capacitance12.5pF); >VALUE: NX-3215; 1: 1; 2: 2
R63-R77 = R0603(1608)
  R63 R64: >VALUE: 250
  R65 R67: >VALUE: 10k
  R66: >VALUE: 300k
  R68-R71: >VALUE: 4.7k
  R72 R73 R75: >VALUE: 0
  R74: >VALUE: 6.2k
  R76 R77: >VALUE: 100k
U17 = MSP430F1611: <b>MSP430F1611</b>; AVcc: AVcc; DVss: DVss; AVss: AVss; P6.2/A2: P6.2/A2; P6.1/A1: P6.1/A1; P6.0/A0: P6.0/A0; RST/NMI: RST/NMI; TCK: TCK; TMS: TMS; TDI/TCLK: TDI/TCLK; TDO/TDI: TDO/TDI; XT2IN: XT2IN; XT2OUT: XT2OUT; P5.7/TBoutH/SVSOUT: P5.7/TBoutH/SVSOUT; P5.6/ACLK: P5.6/ACLK; P5.5/SMCLK: P5.5/SMCLK; DVcc: DVcc; P6.3/A3: P6.3/A3; P6.4/A4: P6.4/A4; P6.5/A5: P6.5/A5; P6.6/A6/DAC0: P6.6/A6/DAC0; P6.7/A7/DAC1/SVSIN: P6.7/A7/DAC1/SVSIN; VREF+: VREF+; XIN: XIN; XOUT/TCLK: XOUT/TCLK; VeREF+: VeREF+; VREF-/VeREF-: VREF-/VeREF-; P1.0/TACLK: P1.0/TACLK; P1.1/TA0: P1.1/TA0; P1.2/TA1: P1.2/TA1; P1.3/TA2: P1.3/TA2; P1.4/SMCLK: P1.4/SMCLK; P1.5/TA0: P1.5/TA0; P1.6/TA1: P1.6/TA1; P1.7/TA2: P1.7/TA2; P2.0/ACLK: P2.0/ACLK; P2.1/TAINCLK: P2.1/TAINCLK; P2.2/CAOUT/TA0: P2.2/CAOUT/TA0; P2.3/CA0/TA1: P2.3/CA0/TA1; P2.4/CA1/TA2: P2.4/CA1/TA2; P2.5/Rosc: P2.5/Rosc; P2.6/ADC12CLK/DMAE0: P2.6/ADC12CLK/DMAE0; P2.7/TA0: P2.7/TA0; P3.0/STE0: P3.0/STE0; P3.1/SIMO0/SDA: P3.1/SIMO0/SDA; P3.2/SOMI0: P3.2/SOMI0; P3.3/UCLK0/SCL: P3.3/UCLK0/SCL; P3.4/UTXD0: P3.4/UTXD0; P5.4/MCLK: P5.4/MCLK; P5.3UCLK1: P5.3UCLK1; P5.2/SOMI1: P5.2/SOMI1; P5.1SIMO1: P5.1SIMO1; P5.0/STE1: P5.0/STE1; P4.7/TBCLK: P4.7/TBCLK; P4.6/TB6: P4.6/TB6; P4.5/TB5: P4.5/TB5; P4.4/TB4: P4.4/TB4; P4.3/TB3: P4.3/TB3; P4.2/TB2: P4.2/TB2; P4.1/TB1: P4.1/TB1; P4.0/TB0: P4.0/TB0; P3.7/URXD1: P3.7/URXD1; P3.6/UTXD1: P3.6/UTXD1; P3.5/URXD0: P3.5/URXD0; >VALUE: MSP430F1611
U18 = MAX6369: <B>MAX6369</B> / <ul> / <li>Pin-Selectable Watchdog Timers</li> / <li>Max 6369 is Open-drain output</li> / <li>1 ms to 60 s seletable timeout</li> / </ul>; WDI: WDI; GND: GND; N.C.: N.C.; SET0: SET0; SET1: SET1; SET2: SET2; /WDO: /WDO; VCC: VCC; >VALUE: MAX6369
U19 = TPS3838: <b>TPS3838</b> / <br /> / NanoPower Supervisory IC from texas instruments.<br /> / TPS3838 is open-drain output; >VALUE: TPS3838; CT: CT; /MR: /MR; GND: GND; VDD: VDD; /RST: /RST
U20 = MAX890L: <B>MAX 890L</B> / <BR /> / 1.2A, Current-Limited, High-Side / P-Channel Switch with Thermal Shutdown BY MAXIM; IN: IN; /ON: /ON; GND: GND; SET: SET; OUT: OUT; /FAULT: /FAULT; >VALUE: MAX890L
U21 = MCP1700_SOT23: MCP1700 LDO from Microchips; >VALUE: MCP1700_SOT23; IN: IN; GND: GND; OUT: OUT
X3 = M03PTH: <b>Header 3</b> / Standard 3-pin 0.1" header. Use with straight break away headers (SKU : PRT-00116), right angle break away headers (PRT-00553), swiss pins (PRT-00743), machine pins (PRT-00117), and female headers (PRT-00115). Molex polarized connector foot print use with SKU : PRT-08232 with associated crimp pins and housings.; >VALUE: M03PTH
U$1 = OSSILOGORECT: OSSI: OSSI; LOGO: LOGO
X4 X5 = P-PAD-S: >VALUE: P-PAD-S
X6 = JTAG10PINMINI-H: >VALUE: JTAG10PINMINI-H

## Nets that join several sheets
3.3VOBC: OSSI-1 OBC_0 (X1.45 X1.46), OSSI-1 OBC_1 (14 pins), OSSI-1 OBC_2 (18 pins), OSSI-1 OBC_3 (17 pins)
GND: OSSI-1 OBC_0 (X1.1 X1.2 X1.51 X1.52), OSSI-1 OBC_1 (33 pins), OSSI-1 OBC_2 (59 pins), OSSI-1 OBC_3 (26 pins)
VBAT: OSSI-1 OBC_0 (X1.11 X1.12), OSSI-1 OBC_1 (R13.2)
VBUS: OSSI-1 OBC_0 (X1.7 X1.8 X1.9 X1.10), OSSI-1 OBC_1 (R15.2), OSSI-1 OBC_2 (U15.23 U15.24), OSSI-1 OBC_3 (U20.1 U20.2)
VSOLAR: OSSI-1 OBC_0 (X1.5 X1.6), OSSI-1 OBC_1 (R17.2), OSSI-1 OBC_2 (C29.P$1 U16.P$5)
VSUPERCAP: OSSI-1 OBC_0 (X1.13), OSSI-1 OBC_1 (R11.2)
ADC0: OSSI-1 OBC_1 (C12.1 R9.1), OSSI-1 OBC_3 (U17.59)
ADC1: OSSI-1 OBC_1 (C17.1 R18.1), OSSI-1 OBC_3 (U17.60)
ANT_DEPLOY1: OSSI-1 OBC_0 (X1.19), OSSI-1 OBC_3 (R70.1)
ANT_DEPLOY2: OSSI-1 OBC_0 (X1.20), OSSI-1 OBC_3 (R69.1)
BAT_-CHRG: OSSI-1 OBC_0 (X1.42), OSSI-1 OBC_2 (U15.18)
BAT_-CHRG_IN: OSSI-1 OBC_2 (R53.2), OSSI-1 OBC_3 (U17.17)
BAT_-FAULT: OSSI-1 OBC_0 (X1.44), OSSI-1 OBC_2 (U15.17)
BAT_-FAULT_IN: OSSI-1 OBC_2 (R52.2), OSSI-1 OBC_3 (U17.16)
BAT_-ON: OSSI-1 OBC_0 (X1.38), OSSI-1 OBC_2 (U15.20)
BAT_-ON_IN: OSSI-1 OBC_2 (R56.2), OSSI-1 OBC_3 (U17.19)
BAT_TEMP: OSSI-1 OBC_0 (X1.47), OSSI-1 OBC_1 (R2.2)
BEACON_-FAULT: OSSI-1 OBC_0 (X1.30), OSSI-1 OBC_2 (R42.1 R43.1)
BEACON_-FAULT_IN: OSSI-1 OBC_2 (R42.2), OSSI-1 OBC_3 (U17.22)
BEACON_OFF: OSSI-1 OBC_0 (X1.24), OSSI-1 OBC_2 (R28.1)
BEACON_OFF_OUT: OSSI-1 OBC_2 (R28.2), OSSI-1 OBC_3 (U17.38)
BEACON_SCL: OSSI-1 OBC_0 (X1.37), OSSI-1 OBC_2 (U14.7)
BEACON_SDA: OSSI-1 OBC_0 (X1.39), OSSI-1 OBC_2 (U14.6)
BUS_CS: OSSI-1 OBC_0 (X1.27), OSSI-1 OBC_1 (R4.2)
COMMS_-FAULT: OSSI-1 OBC_0 (X1.32), OSSI-1 OBC_2 (R32.1 R34.1)
COMMS_-FAULT_IN: OSSI-1 OBC_2 (R32.2), OSSI-1 OBC_3 (U17.21)
COMMS_OFF: OSSI-1 OBC_0 (X1.25), OSSI-1 OBC_2 (R26.1)
COMMS_OFF_OUT: OSSI-1 OBC_2 (R26.2), OSSI-1 OBC_3 (U17.37)
COMMS_SCL: OSSI-1 OBC_0 (X1.41), OSSI-1 OBC_2 (U14.5)
COMMS_SDA: OSSI-1 OBC_0 (X1.43), OSSI-1 OBC_2 (U14.4)
DE: OSSI-1 OBC_2 (R35.2 U13.3), OSSI-1 OBC_3 (U17.48)
GYRO_-CS: OSSI-1 OBC_2 (U10.4), OSSI-1 OBC_3 (U17.44)
GYRO_SCLK: OSSI-1 OBC_2 (U10.16), OSSI-1 OBC_3 (U17.47)
GYRO_SI: OSSI-1 OBC_2 (U10.15), OSSI-1 OBC_3 (U17.45)
GYRO_SO: OSSI-1 OBC_2 (U10.5), OSSI-1 OBC_3 (U17.46)
I2C_-RST: OSSI-1 OBC_2 (R48.1 U14.3), OSSI-1 OBC_3 (U17.28)
I2C_SCL: OSSI-1 OBC_2 (U14.22), OSSI-1 OBC_3 (R64.1 R67.1)
I2C_SDA: OSSI-1 OBC_2 (U14.23), OSSI-1 OBC_3 (R63.1 R65.1)
IO_-OE: OSSI-1 OBC_2 (R62.1 U15.22), OSSI-1 OBC_3 (U17.24)
LED_-FAULT: OSSI-1 OBC_0 (X1.28), OSSI-1 OBC_2 (R44.1 R46.1)
LED_-FAULT_IN: OSSI-1 OBC_2 (R44.2), OSSI-1 OBC_3 (U17.23)
LED_OFF: OSSI-1 OBC_0 (X1.23), OSSI-1 OBC_2 (R29.1)
LED_OFF_OUT: OSSI-1 OBC_2 (R29.2), OSSI-1 OBC_3 (U17.39)
LED_SCL: OSSI-1 OBC_0 (X1.33), OSSI-1 OBC_2 (U14.9)
LED_SDA: OSSI-1 OBC_0 (X1.35), OSSI-1 OBC_2 (U14.8)
MUX_A0: OSSI-1 OBC_1 (U2.1 U5.1), OSSI-1 OBC_3 (R73.2)
MUX_A1: OSSI-1 OBC_1 (U2.16 U5.16), OSSI-1 OBC_3 (R72.2)
MUX_A2: OSSI-1 OBC_1 (U2.15 U5.15), OSSI-1 OBC_3 (U17.51)
OBC_-FAULT: OSSI-1 OBC_0 (X1.34), OSSI-1 OBC_3 (U20.8)
OBC_I2C_OFF: OSSI-1 OBC_2 (R27.1 U9.P$3), OSSI-1 OBC_3 (U17.30)
OBC_OFF: OSSI-1 OBC_0 (X1.26), OSSI-1 OBC_3 (C38.1 R76.2 U20.3)
PANELTEMP_SCL: OSSI-1 OBC_0 (X1.29), OSSI-1 OBC_2 (R59.1 U14.11)
PANELTEMP_SDA: OSSI-1 OBC_0 (X1.31), OSSI-1 OBC_2 (R60.1 U14.10)
RTC_-INT: OSSI-1 OBC_2 (R20.1 U7.3), OSSI-1 OBC_3 (U17.26)
RXD1: OSSI-1 OBC_2 (R39.1), OSSI-1 OBC_3 (U17.35)
SC_-ON: OSSI-1 OBC_0 (X1.40), OSSI-1 OBC_2 (U15.19)
SC_-ON_IN: OSSI-1 OBC_2 (R55.2), OSSI-1 OBC_3 (U17.18)
SC_-PFO: OSSI-1 OBC_0 (X1.48), OSSI-1 OBC_2 (U15.16)
SC_-PFO_IN: OSSI-1 OBC_2 (R51.2), OSSI-1 OBC_3 (U17.15)
SCCHG_EN: OSSI-1 OBC_0 (X1.21), OSSI-1 OBC_2 (R23.1)
SCCHG_EN_OUT: OSSI-1 OBC_2 (R23.2), OSSI-1 OBC_3 (U17.41)
SCOUT_-PG: OSSI-1 OBC_0 (X1.50), OSSI-1 OBC_2 (U15.15)
SCOUT_-PG_IN: OSSI-1 OBC_2 (R50.2), OSSI-1 OBC_3 (U17.14)
SCOUT_EN: OSSI-1 OBC_0 (X1.22), OSSI-1 OBC_2 (R22.1)
SCOUT_EN_OUT: OSSI-1 OBC_2 (R22.2), OSSI-1 OBC_3 (U17.40)
SOLAR_-ON: OSSI-1 OBC_0 (X1.36), OSSI-1 OBC_2 (U15.21)
SOLAR_-ON_IN: OSSI-1 OBC_2 (R57.2), OSSI-1 OBC_3 (U17.20)
SOLAR_CS1: OSSI-1 OBC_0 (X1.15), OSSI-1 OBC_1 (R8.2)
SOLAR_CS2: OSSI-1 OBC_0 (X1.14), OSSI-1 OBC_1 (R7.2)
SOLAR_CS3: OSSI-1 OBC_0 (X1.17), OSSI-1 OBC_1 (R6.2)
SOLAR_CS4: OSSI-1 OBC_0 (X1.16), OSSI-1 OBC_1 (R5.2)
SOLAR_CS5: OSSI-1 OBC_0 (X1.18), OSSI-1 OBC_1 (R3.2)
SUPERCAP_TEMP: OSSI-1 OBC_0 (X1.49), OSSI-1 OBC_1 (R1.2)
TEMP_-ALERT: OSSI-1 OBC_2 (R33.2 U12.3), OSSI-1 OBC_3 (U17.27)
TXD1: OSSI-1 OBC_2 (R36.1), OSSI-1 OBC_3 (U17.34)
VEXT_OFF: OSSI-1 OBC_2 (R49.1 U16.P$3), OSSI-1 OBC_3 (U17.36)
VREF_EXT: OSSI-1 OBC_1 (C13.2 U4.4), OSSI-1 OBC_3 (U17.10)